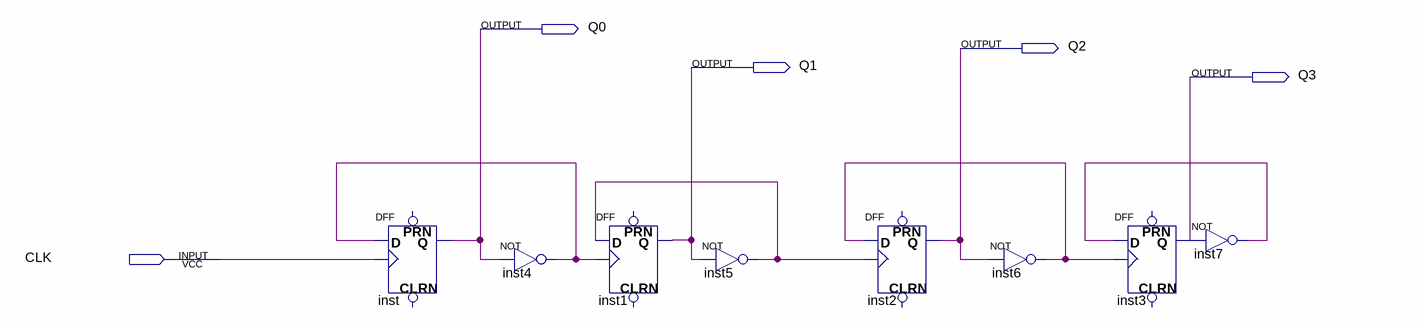
[diagram p0: schematic sheet]
// Quartus schematic count1.bdf as structural Verilog: 8 symbols, 5 pins
module count1 (
  input  CLK,
  output Q0,
  output Q2,
  output Q1,
  output Q3
);

  wire inst4_out, inst5_out, inst6_out, inst7_out;

  DFF inst (.CLK(CLK), .D(inst4_out), .Q(Q0));  // open: CLRN, PRN
  not inst4 (inst4_out, Q0);
  DFF inst1 (.CLK(inst4_out), .D(inst5_out), .Q(Q1));  // open: CLRN, PRN
  not inst5 (inst5_out, Q1);
  DFF inst2 (.CLK(inst5_out), .D(inst6_out), .Q(Q2));  // open: CLRN, PRN
  not inst6 (inst6_out, Q2);
  DFF inst3 (.CLK(inst6_out), .D(inst7_out), .Q(Q3));  // open: CLRN, PRN
  not inst7 (inst7_out, Q3);
endmodule
